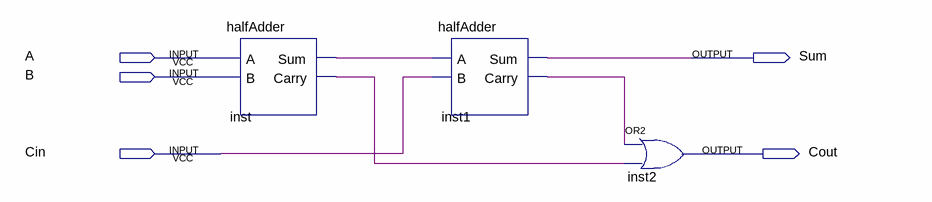
[diagram p0: schematic sheet]
// Quartus schematic fullAdder.bdf as structural Verilog: 3 symbols, 5 pins
module fullAdder (
  input  A,
  input  B,
  input  Cin,
  output Sum,
  output Cout
);

  wire inst1_carry, inst_carry, inst_sum;

  halfAdder inst (.A(A), .B(B), .Sum(inst_sum), .Carry(inst_carry));
  halfAdder inst1 (.A(inst_sum), .B(Cin), .Sum(Sum), .Carry(inst1_carry));
  or inst2 (Cout, inst1_carry, inst_carry);
endmodule
